# EAGLE design Contactless (EAGLE 9.6.2)
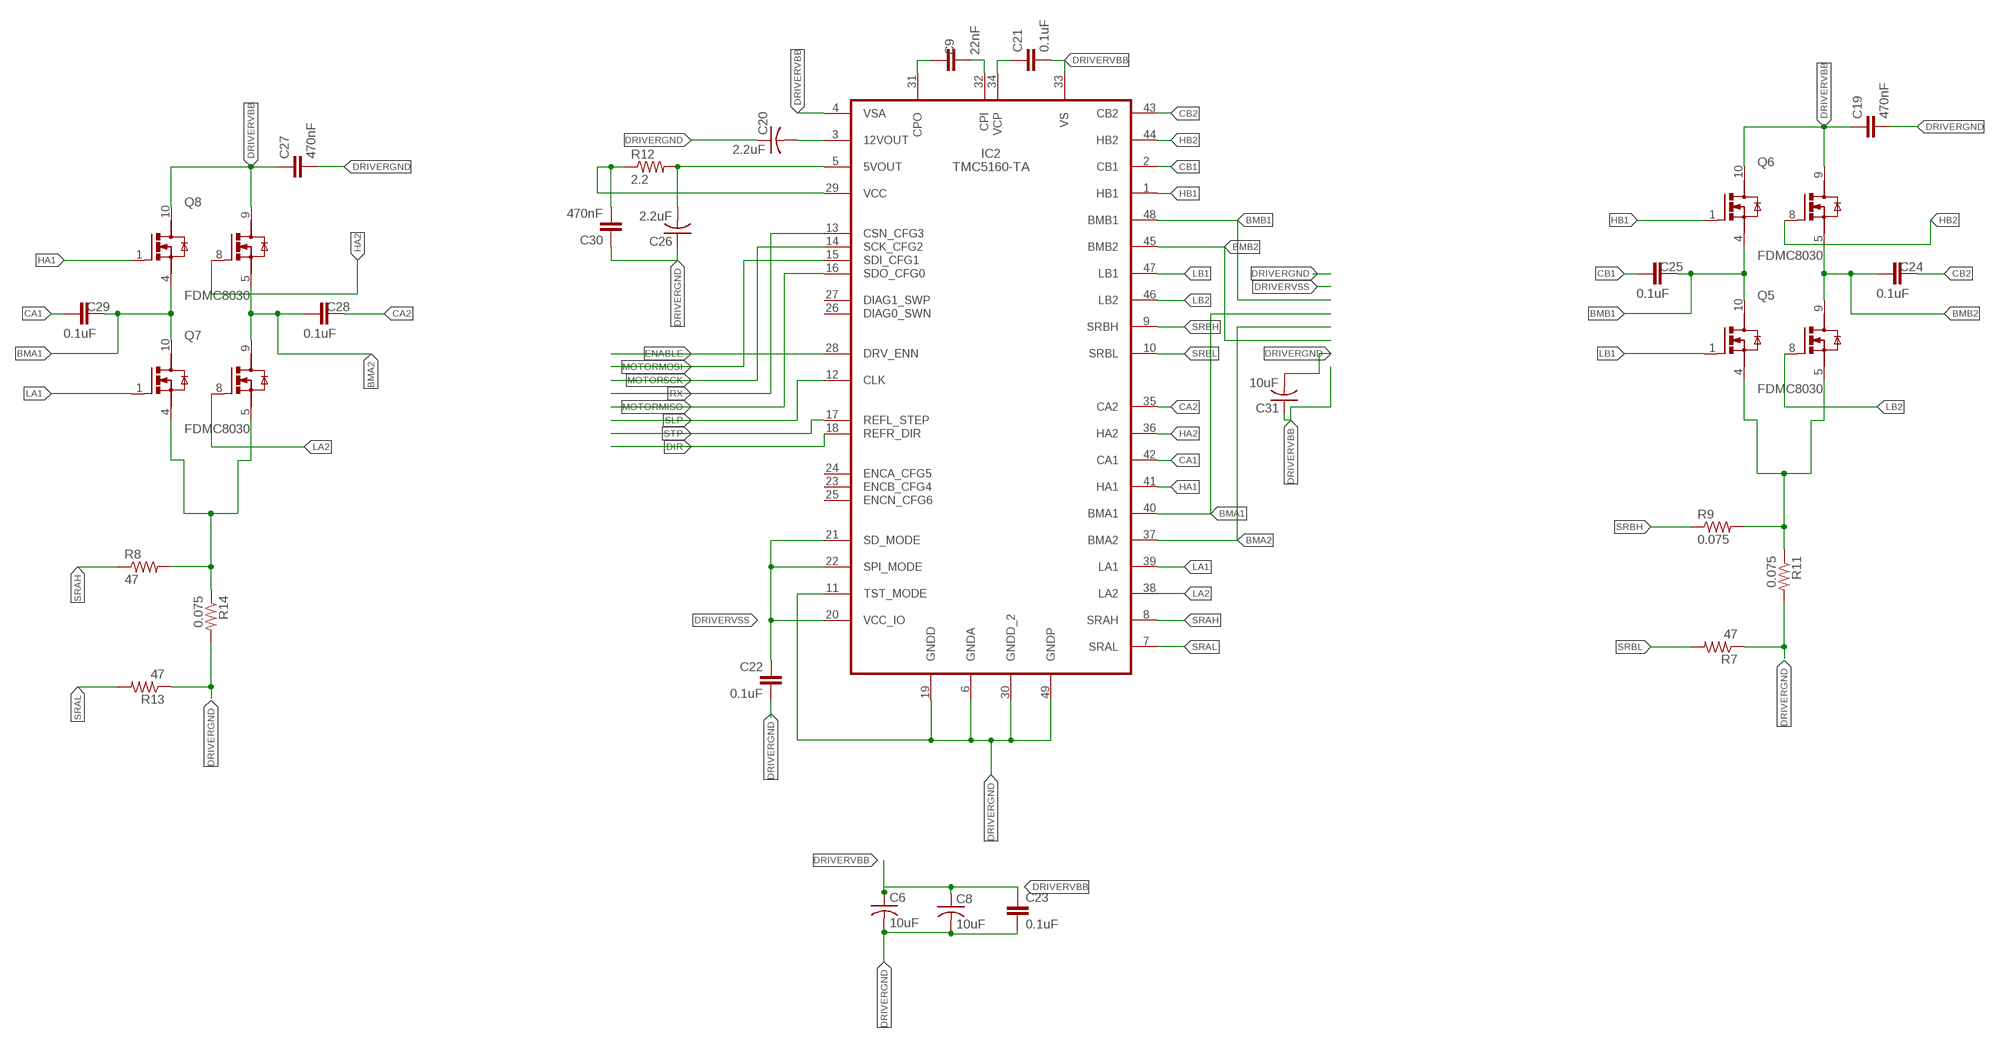
[diagram p0: schematic, sheet 1]

## Parts
C6  10uF  C-USC0805  [C0805]
C8  10uF  C-USC0805  [C0805]
C9  22nF  22NF/22,000PF-0603-50V-10%  [0603]
C19  470nF  470NF-0402-16V-10%  [0402]
C20  2.2uF  C-USC0402  [C0402]
C21  0.1uF  0.1UF-0402-16V-10%  [0402]
C22  0.1uF  0.1UF-0402-16V-10%  [0402]
C23  0.1uF  0.1UF-0402-16V-10%  [0402]
C24  0.1uF  0.1UF-0402-16V-10%  [0402]
C25  0.1uF  0.1UF-0402-16V-10%  [0402]
C26  2.2uF  C-USC0402  [C0402]
C27  470nF  470NF-0402-16V-10%  [0402]
C28  0.1uF  0.1UF-0402-16V-10%  [0402]
C29  0.1uF  0.1UF-0402-16V-10%  [0402]
C30  470nF  470NF-0402-16V-10%  [0402]
C31  10uF  C-USC0805  [C0805]
IC2  TMC5160-TA  [TQFP48-EP]
Q5  FDMC8030  [TRANS_FDMC8030]
Q6  FDMC8030  [TRANS_FDMC8030]
Q7  FDMC8030  [TRANS_FDMC8030]
Q8  FDMC8030  [TRANS_FDMC8030]
R7  47  R-US_R0402  [R0402]
R8  47  R-US_R0402  [R0402]
R9  0.075  R-US_R1206  [R1206]
R11  0.075  R-US_R1206  [R1206]
R12  2.2  R-US_R0402  [R0402]
R13  47  R-US_R0402  [R0402]
R14  0.075  R-US_R1206  [R1206]

## Nets
BMA1: C29.2 IC2.40(BMA1) Q7.10(D1) Q8.4(S1)
BMA2: C28.1 IC2.37(BMA2) Q7.9(D2) Q8.5(S2)
BMB1: C25.2 IC2.48(BMB1) Q5.10(D1) Q6.4(S1)
BMB2: C24.1 IC2.45(BMB2) Q5.9(D2) Q6.5(S2)
CA1: C29.1 IC2.42(CA1)
CA2: C28.2 IC2.35(CA2)
CB1: C25.1 IC2.2(CB1)
CB2: C24.2 IC2.43(CB2)
DIR: IC2.18(REFR_DIR)
DRIVERGND: C6.2 C8.2 C19.2 C20.1 C22.2 C23.2 C26.1 C27.2 C30.1 C31.2 IC2.6(GNDA) IC2.11(TST_MODE) IC2.19(GNDD) IC2.30(GNDD_2) IC2.49(GNDP) R7.1 R11.2 R13.1 R14.2
DRIVERVBB: C6.1 C8.1 C19.1 C21.2 C23.1 C27.1 C31.1 IC2.4(VSA) IC2.33(VS) Q6.9(D2) Q6.10(D1) Q8.9(D2) Q8.10(D1)
DRIVERVSS: C22.1 IC2.20(VCC_IO) IC2.21(SD_MODE) IC2.22(SPI_MODE)
ENABLE: IC2.28(DRV_ENN)
HA1: IC2.41(HA1) Q8.1(G1)
HA2: IC2.36(HA2) Q8.8(G2)
HB1: IC2.1(HB1) Q6.1(G1)
HB2: IC2.44(HB2) Q6.8(G2)
LA1: IC2.39(LA1) Q7.1(G1)
LA2: IC2.38(LA2) Q7.8(G2)
LB1: IC2.47(LB1) Q5.1(G1)
LB2: IC2.46(LB2) Q5.8(G2)
MOTORMISO: IC2.16(SDO_CFG0)
MOTORMOSI: IC2.15(SDI_CFG1)
MOTORSCK: IC2.14(SCK_CFG2)
N$1: C21.1 IC2.34(VCP)
N$2: C9.1 IC2.31(CPO)
N$3: C9.2 IC2.32(CPI)
N$4: C20.2 IC2.3(12VOUT)
N$5: C26.2 IC2.5(5VOUT) R12.2
N$6: C30.2 IC2.29(VCC) R12.1
N$7: Q5.4(S1) Q5.5(S2) R9.2 R11.1
N$8: Q7.4(S1) Q7.5(S2) R8.2 R14.1
RX: IC2.13(CSN_CFG3)
SLP: IC2.12(CLK)
SRAH: IC2.8(SRAH) R8.1
SRAL: IC2.7(SRAL) R13.2
SRBH: IC2.9(SRBH) R9.1
SRBL: IC2.10(SRBL) R7.2
STP: IC2.17(REFL_STEP)
Unconnected: IC2.23(ENCB_CFG4) IC2.24(ENCA_CFG5) IC2.25(ENCN_CFG6) IC2.26(DIAG0_SWN) IC2.27(DIAG1_SWP)

## Library data of the parts
C6 C8 C20 C26 C31 = adafruit:C-US: CAPACITOR, American symbol
C9 = SparkFun-Capacitors:22NF/22,000PF: 0.022uF/22nF/22,000pF ceramic capacitors A capacitor is a passive two-terminal electrical component used to store electrical energy temporarily in an electric field.; PROD_ID: CAP-07885
C19 C27 C30 = SparkFun-Capacitors:470NF: 0.47uF/470nF ceramic capacitors A capacitor is a passive two-terminal electrical component used to store electrical energy temporarily in an electric field.; PROD_ID: CAP-09041
C21-C25 C28 C29 = SparkFun-Capacitors:0.1UF: 0.1µF ceramic capacitors A capacitor is a passive two-terminal electrical component used to store electrical energy temporarily in an electric field.; PROD_ID: CAP-12416
IC2 = TMC5160-TA:TMC5160-TA: Universal high voltage controller for two-phase bipolar stepper motor. TQFP48-EP; AVAILABILITY: Unavailable; DESCRIPTION: Bipolar Motor Driver BCD MOS External Power MOSFETs SPI, Step/Direction 48-TQFP-EP _7x7_; MF: Trinamic Motion; MP: TMC5160-TA; PACKAGE: TQFP-48 Trinamic Motion; PRICE: None
Q5-Q8 = FDMC8030:FDMC8030: Dual N-Channel Power Trench® MOSFET 40 V, 12 A, 10 mΩ; AVAILABILITY: Unavailable; DESCRIPTION: Mosfet Array 2 N-Channel _Dual_ 40V 12A 800mW Surface Mount 8-Power33 _3x3_; MF: ON Semiconductor; MP: FDMC8030; PACKAGE: PowerWDFN-8 ON Semiconductor; PRICE: None
R7-R9 R11-R14 = adafruit:R-US_: RESISTOR, American symbol

## Board
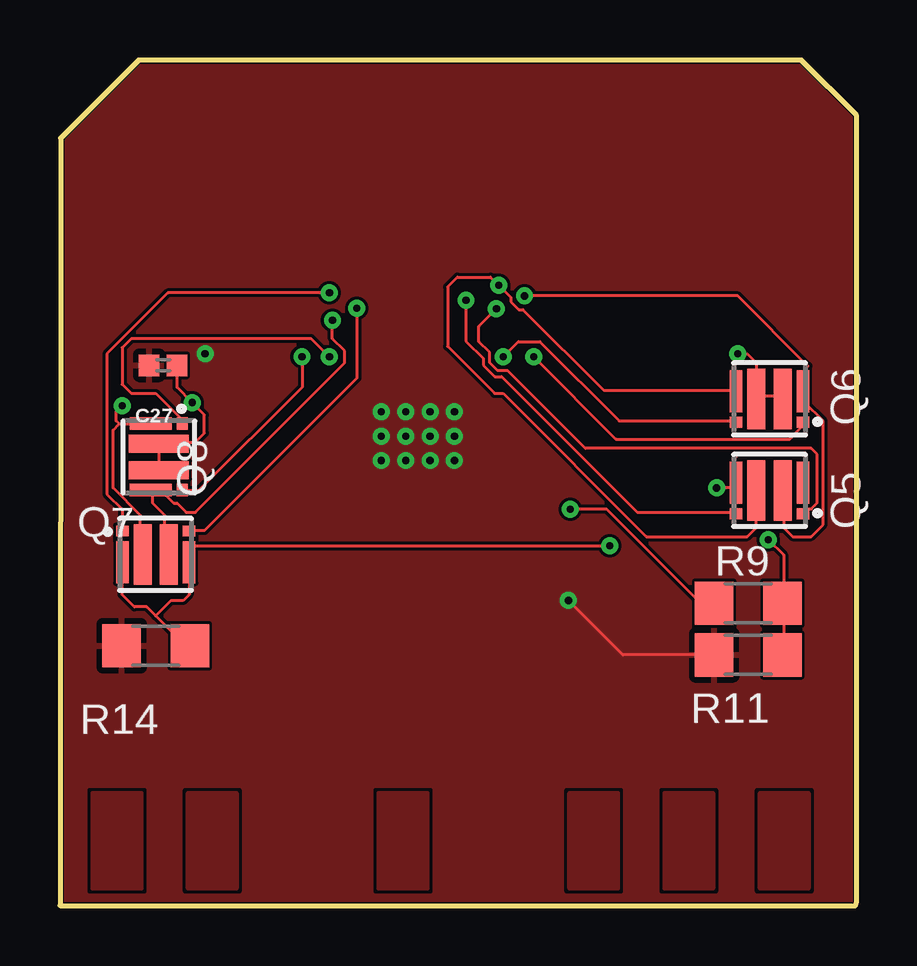
[diagram p1: board, top side]
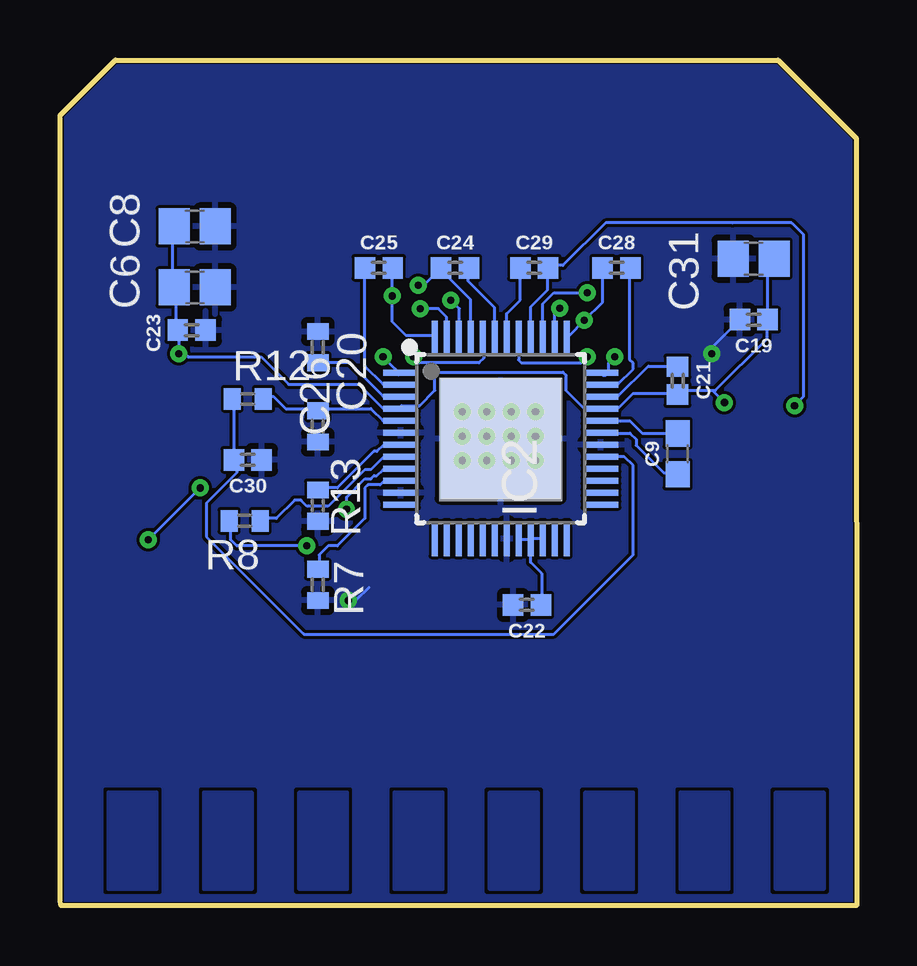
[diagram p2: board, bottom side, seen from below]

Size 33.2 x 35.23 mm. Coordinates in mm from the lower left corner, seen from the top.
Outline: 33.2,0.15 33.2,32.92 30.89,35.23 3.28,35.23 0.03,31.98 0,0 33.15,0 33.2,0.15
Copper layers (1*16): Top 0.035mm / dielectric 1.5mm / Bottom 0.035mm
Design rules "default *": minimum track width 5mil, minimum drill 0.3mm, track to track 5mil, track to pad 6mil, pad to pad 6mil, via to via 6mil, smd to smd 6mil, copper to edge 2mil, drill to drill 6mil, minimum pad ring 10mil, minimum via ring 8mil, stop-mask expansion 4mil, vias tented up to drill 0mil, thermal gap 10mil

### Footprints (pad centres in the part's own frame; a part is rotated, then mirrored left to right if it is on the bottom)
C0805 = smd 1.3 x 1.5: 1 -0.85,0; 2 0.85,0
0603 = smd 1.1 x 1: 1 -0.85,0; 2 0.85,0
0402 = smd 0.85 x 0.9: 1 -0.58,0; 2 0.58,0
C0402 = smd 0.7 x 0.9: 1 -0.65,0; 2 0.65,0
TQFP48-EP = smd 0.25 x 1.45: 1 -2.75,-4.175; 2 -2.25,-4.175; 3 -1.75,-4.175; 4 -1.25,-4.175; 5 -0.75,-4.175; 6 -0.25,-4.175; 7 0.25,-4.175; 8 0.75,-4.175; 9 1.25,-4.175; 10 1.75,-4.175; 11 2.25,-4.175; 12 2.75,-4.175; 25 2.75,4.175; 26 2.25,4.175; 27 1.75,4.175; 28 1.25,4.175; 29 0.75,4.175; 30 0.25,4.175; 31 -0.25,4.175; 32 -0.75,4.175; 33 -1.25,4.175; 34 -1.75,4.175; 35 -2.25,4.175; 36 -2.75,4.175 | smd 1.45 x 0.25: 13 4.175,-2.75; 14 4.175,-2.25; 15 4.175,-1.75; 16 4.175,-1.25; 17 4.175,-0.75; 18 4.175,-0.25; 19 4.175,0.25; 20 4.175,0.75; 21 4.175,1.25; 22 4.175,1.75; 23 4.175,2.25; 24 4.175,2.75; 37 -4.175,2.75; 38 -4.175,2.25; 39 -4.175,1.75; 40 -4.175,1.25; 41 -4.175,0.75; 42 -4.175,0.25; 43 -4.175,-0.25; 44 -4.175,-0.75; 45 -4.175,-1.25; 46 -4.175,-1.75; 47 -4.175,-2.25; 48 -4.175,-2.75 | smd 5 x 5: 49 0,0
TRANS_FDMC8030 = smd 0.52 x 0.45: 1 -1.39,0.975; 8 1.39,0.975 | smd 0.52 x 1.75: 4 -1.39,-0.325; 5 1.39,-0.325 | smd 0.75 x 2.52: 9 0.55,0; 10 -0.55,0
R0402 = smd 0.7 x 0.9: 1 -0.65,0; 2 0.65,0
R1206 = smd 1.6 x 1.803: 1 -1.422,0; 2 1.422,0

### Placement (x,y rotation side)
C6  27.58,25.76 0 bottom
C8  27.58,28.3 0 bottom
C9  7.47,18.82 90 bottom
C19  4.29,24.41 180 bottom
C20  22.45,23.27 270 bottom
C21  7.47,21.87 270 bottom
C22  13.74,12.52 180 bottom
C23  27.71,23.98 0 bottom
C24  16.74,26.57 0 bottom
C25  19.91,26.57 0 bottom
C26  22.45,19.96 90 bottom
C27  4.29,22.5 180 top
C28  10.01,26.57 0 bottom
C29  13.44,26.57 0 bottom
C30  25.37,18.57 180 bottom
C31  4.29,26.95 180 bottom
IC2  14.83,19.46 270 bottom
Q5  29.57,17.3 180 top
Q6  29.57,21.11 180 top
Q7  3.99,14.63 0 top
Q8  4.11,18.69 270 top
R7  22.45,13.36 90 bottom
R8  25.5,16.03 180 bottom
R9  28.68,12.6 0 top
R11  28.68,10.44 180 top
R12  25.37,21.11 0 bottom
R13  22.45,16.66 90 bottom
R14  3.99,10.82 180 top

### Tracks (layer width: path | path; a pad name or v marks a point on that pad's centre or on a via)
BMA1  (via drill 0.3)
  Top 0.127: 2.46,20.07 3.73,20.07 Q8.4 | 2.46,20.07 2.21,19.81 2.21,17.4 3.35,16.26 3.35,14.73 Q7.10 | v2.59,20.83 2.34,20.57 2.34,20.19 2.46,20.07
  Bottom 0.127: v2.59,20.83 2.21,21.21 2.21,27.94 2.72,28.45 5.18,28.45 10.46,28.45 12.24,26.67 12.75,26.67 C29.2 12.88,26.54 12.88,25.65 13.58,24.95 IC2.40
  pour Top: 29.18,4.68 31.17,4.68 31.17,0.71 29.18,0.71
BMA2  (via drill 0.3)
  Top 0.127: 3.86,17.15 3.86,16.76 4.37,16.26 4.37,14.86 4.5,14.73 Q7.9 | 3.86,17.15 3.86,17.27 Q8.5 3.86,17.15 | v11.35,24.38 11.35,23.62 11.86,23.11 11.86,22.61 5.64,16.38 5.26,16.38 4.88,16.76 4.75,16.76 4.37,17.15 3.86,17.15
  Bottom 0.127: C28.1 10.59,26.54 10.59,25.15 v11.35,24.38 11.99,23.75 IC2.37
  pour Top: 1.38,4.68 3.37,4.68 3.37,0.71 1.38,0.71
BMB1  (via drill 0.3)
  Top 0.127: Q5.10 30.15,17.27 30.15,15.75 30.53,15.37 31.29,15.37 31.8,15.88 31.8,20.19 31.04,20.96 31.04,21.34 Q6.4 31.04,21.46 31.04,22.35 31.17,22.48 28.24,25.4 v19.35,25.4
  Bottom 0.127: C25.2 19.35,26.54 v19.35,25.4 19.35,24.33 18.77,23.75 17.7,23.75 IC2.48
  pour Top: 25.21,4.68 27.2,4.68 27.2,0.71 25.21,0.71
BMB2  (via drill 0.3)
  Top 0.127: Q6.5 28.12,21.46 22.66,21.46 19.29,24.83 19.12,24.83 18.79,25.16 18.79,25.33 v18.27,25.85 17.93,26.19 16.56,26.19 16.19,25.82 | 16.19,25.82 16.15,25.78 16.15,23.29 18.11,21.34 18.47,21.34 24.44,15.37 28.63,15.37 29.01,15.75 29.01,17.27 Q5.9 | 16.19,25.82
  Bottom 0.127: 16.05,23.75 IC2.45 16.08,25.23 17.32,26.47 C24.1 18.04,25.85 v18.27,25.85
  pour Top: 5.35,4.68 7.34,4.68 7.34,0.71 5.35,0.71
CA1
  Bottom 0.127: C29.1 14.02,26.54 14.02,25.22 14.58,24.66 IC2.42
CA2
  Bottom 0.127: C28.2 9.45,26.54 9.45,22.73 9.32,22.61 9.32,22.35 9.96,21.72 10.59,21.72 IC2.35
CB1
  Bottom 0.127: C25.1 20.5,26.54 20.5,22.48 19.74,21.72 19.1,21.72 IC2.2
CB2
  Bottom 0.127: C24.2 16.18,26.54 16.18,26.01 15.08,24.91 IC2.43
DIR
  pour Bottom: 29.18,4.68 31.17,4.68 31.17,0.71 29.18,0.71
DRIVERGND  (via drill 0.3)
  Top 0.127: R11.2 23.45,10.44 v21.18,12.71
  Bottom 0.127: C19.2 6.04,23.24 v6.04,22.99 | v21.18,12.71 20.87,12.71 20.32,13.26
  other vias: 16.43,18.54 15.42,18.54 14.4,18.54 13.39,18.54 13.39,19.56 14.4,19.56 15.42,19.56 16.43,19.56 16.43,20.57 15.42,20.57 14.4,20.57 13.39,20.57
  pour Top: 11.53,22.5 11.91,22.89 18.01,22.89 18.26,22.63 18.26,16.28 18.01,16.03 12.04,16.03 11.53,16.54
  pour Top: 9.32,4.68 11.31,4.68 11.31,0.71 9.32,0.71
  pour Top: 17.27,4.68 19.25,4.68 19.25,0.71 17.27,0.71
  pour Top (rank 2): 0.11,32.29 0.11,5.39 0.1,-0.13 33.19,-0.24 33.2,8.51 33.2,33.12 31.01,35.31 3.12,35.31
  pour Bottom (rank 2): 0.03,31.98 0,0 33.15,0 33.2,0.15 33.2,32.92 30.89,35.23 3.28,35.23
DRIVERVBB  (via drill 0.3)
  Top 0.127: C27.1 4.88,22.48 4.88,21.59 v5.51,20.96 6.02,20.45 6.02,19.68 5.64,19.3 4.11,19.3 Q8.10 Q8.9 | Q6.10 30.02,21.21 29.13,21.21 Q6.9 29.01,21.21 29.01,22.61 28.63,22.99 v28.24,22.99
  Bottom 0.127: C31.1 3.48,26.92 3.73,26.67 3.73,24.51 C19.1 3.73,24.38 3.73,23.62 5.89,21.46 6.02,21.46 | 6.02,21.46 7.29,21.46 7.42,21.34 C21.2 7.54,21.34 9.32,21.34 9.96,20.7 10.59,20.7 IC2.33 10.72,20.7 11.35,20.7 12.12,21.46 12.12,22.1 12.24,22.23 17.45,22.23 17.58,22.1 17.58,21.46 18.21,20.83 18.97,20.83 IC2.4 19.1,20.7 19.74,20.7 20.75,21.72 23.67,21.72 24.82,22.86 27.86,22.86 28.12,23.11 | 6.02,21.46 v5.51,20.96 | 28.12,23.11 28.24,23.24 28.24,23.88 C23.1 28.37,24 28.37,25.65 C6.1 28.5,25.78 28.5,28.19 C8.1 | 28.12,23.11 v28.24,22.99
  pour Top: 13.3,4.68 15.28,4.68 15.28,0.71 13.3,0.71
DRIVERVSS
  Bottom 0.127: C22.1 13.13,12.57 13.13,13.84 13.58,14.29 13.58,15.26 | 13.58,15.26 IC2.21 IC2.22 | IC2.20 14.07,15.26 13.58,15.26
  pour Top: 21.24,4.68 23.23,4.68 23.23,0.71 21.24,0.71
ENABLE
  pour Bottom: 1.38,4.68 3.37,4.68 3.37,0.71 1.38,0.71
HA1  (via drill 0.3)
  Top 0.127: v11.23,22.86 10.46,23.62 2.97,23.62 2.59,23.24 2.59,21.72 2.97,21.34 3.99,21.34 5,20.32 5,20.19 Q8.1
  Bottom 0.127: v11.23,22.86 11.48,22.61 13.97,22.61 14.08,22.72 IC2.41
HA2  (via drill 0.3)
  Top 0.127: v10.08,22.86 10.08,21.59 5.77,17.27 5.13,17.27 Q8.8
  Bottom 0.127: v10.08,22.86 10.34,22.61 10.34,22.23 10.46,22.1 10.59,22.1 IC2.36
HB1  (via drill 0.3)
  Top 0.127: v19.74,22.86 23.16,19.43 30.4,19.43 30.91,19.94 30.91,20.07 Q6.1
  Bottom 0.127: v19.74,22.86 19.23,22.35 19.23,22.23 19.1,22.1 IC2.1
HB2  (via drill 0.3)
  Top 0.127: v18.47,22.86 19.1,23.49 19.99,23.49 23.29,20.19 28.12,20.19 Q6.8
  Bottom 0.127: v18.47,22.86 18.47,22.84 18.24,22.61 15.75,22.61 15.54,22.81 15.54,23.59 IC2.44
LA1  (via drill 0.3)
  Top 0.127: v11.23,25.53 4.5,25.53 1.96,22.99 1.96,17.15 2.59,16.51 2.59,15.62 Q7.1
  Bottom 0.127: v11.23,25.53 12.62,25.53 13.08,25.07 IC2.39
LA2  (via drill 0.3)
  Top 0.127: v12.37,24.89 12.37,21.97 6.02,15.62 5.38,15.62 Q7.8
  Bottom 0.127: IC2.38 12.58,24.68 v12.37,24.89
LB1  (via drill 0.3)
  Top 0.127: Q5.1 31.16,16.53 31.3,16.53 31.55,16.77 31.55,18.8 31.29,19.05 21.89,19.05 18.65,22.29 18.23,22.29 17.9,22.62 17.9,23.05 17.45,23.49 17.45,24.13 v18.19,24.87
  Bottom 0.127: v18.19,24.87 17.43,24.87 17.08,24.51 IC2.47
LB2  (via drill 0.3)
  Top 0.127: v16.92,25.22 16.92,23.52 17.64,22.79 17.64,22.52 18.12,22.04 18.4,22.04 24.05,16.38 28.12,16.38 Q5.8
  Bottom 0.127: v16.92,25.22 16.56,24.87 16.56,23.75 IC2.46
MOTORMISO
  pour Bottom: 17.27,4.68 19.25,4.68 19.25,0.71 17.27,0.71
MOTORMOSI
  pour Bottom: 5.35,4.68 7.34,4.68 7.34,0.71 5.35,0.71
MOTORSCK
  pour Bottom: 9.32,4.68 11.31,4.68 11.31,0.71 9.32,0.71
N$1
  Bottom 0.127: C21.1 7.54,22.48 8.69,22.48 9.96,21.21 10.59,21.21 IC2.34
N$2
  Bottom 0.127: C9.1 7.54,18.03 8.05,18.03 9.19,19.18 9.19,19.43 9.45,19.68 10.59,19.68 IC2.31
N$3
  Bottom 0.127: C9.2 7.54,19.68 8.94,19.68 9.45,20.19 10.59,20.19 IC2.32
N$4
  Bottom 0.127: C20.2 22.4,22.61 21.13,22.61 19.74,21.21 19.1,21.21 IC2.3
N$5
  Bottom 0.127: R12.2 24.69,21.21 24.31,21.21 23.8,20.7 22.53,20.7 C26.2 22.4,20.7 20.24,20.7 19.74,20.19 19.1,20.19 IC2.5
N$6
  Bottom 0.127: R12.1 25.96,21.08 25.96,18.67 C30.2 25.83,18.54 25.83,18.03 27.1,16.76 27.1,15.37 23.04,11.3 12.62,11.3 9.32,14.6 9.32,17.91 9.32,17.96 9.32,18.34 9.69,18.71 IC2.29
N$7  (via drill 0.3)
  Top 0.127: R11.1 30.15,10.54 30.15,12.57 R9.2 30.15,12.7 30.15,14.6 v29.51,15.24 | Q5.4 31.04,17.65 31.04,18.67 30.91,18.8 28.27,18.8 28.12,18.64 28.12,17.65 Q5.5 28.12,17.53 27.99,17.4 v27.36,17.4
  Bottom 0.127: v27.36,17.4 v29.51,15.24
N$8  (via drill 0.3)
  Top 0.127: 3.99,12.06 5.13,10.92 5.38,10.92 R14.1 | 3.99,12.06 3.61,12.45 3.1,12.45 2.59,12.95 2.59,14.22 Q7.4 | v22.91,14.99 5.64,14.99 5.38,14.73 5.38,14.35 Q7.5 5.38,14.22 5.38,12.95 5.13,12.7 4.62,12.7 3.99,12.06
  Bottom 0.127: v22.91,14.99 25.83,14.99 26.09,15.24 26.09,16 R8.2
RX
  pour Bottom: 13.3,4.68 15.28,4.68 15.28,2.7 15.28,0.71 13.3,0.71
SLP
  pour Bottom: 21.24,4.68 23.23,4.68 23.23,0.71 21.24,0.71
SRAH
  Bottom 0.127: R8.1 24.82,16.13 24.18,16.13 23.42,16.89 23.16,16.89 22.91,16.64 22.02,16.64 20.5,18.16 20.24,18.16 19.74,18.67 19.1,18.67 IC2.8
SRAL
  Bottom 0.127: R13.2 22.4,17.4 21.64,17.4 20.12,18.92 19.99,18.92 19.74,19.18 19.1,19.18 IC2.7
SRBH  (via drill 0.3)
  Top 0.127: v21.26,16.51 22.78,16.51 26.59,12.7 27.23,12.7 R9.1
  Bottom 0.127: v21.26,16.51 21.26,17.02 20.5,17.78 20.24,17.78 20.12,17.91 19.99,17.91 19.74,18.16 19.1,18.16 IC2.9
SRBL
  Bottom 0.127: R7.2 22.4,14.1 22.4,14.6 22.02,14.99 21.64,14.99 20.5,16.13 20.5,17.4 20.37,17.53 19.86,17.53 19.74,17.65 19.1,17.65 IC2.10
STP
  pour Bottom: 25.21,4.68 27.2,4.68 27.2,2.7 27.2,0.71 25.21,0.71